# EAGLE design q3 (EAGLE 9.6.2)
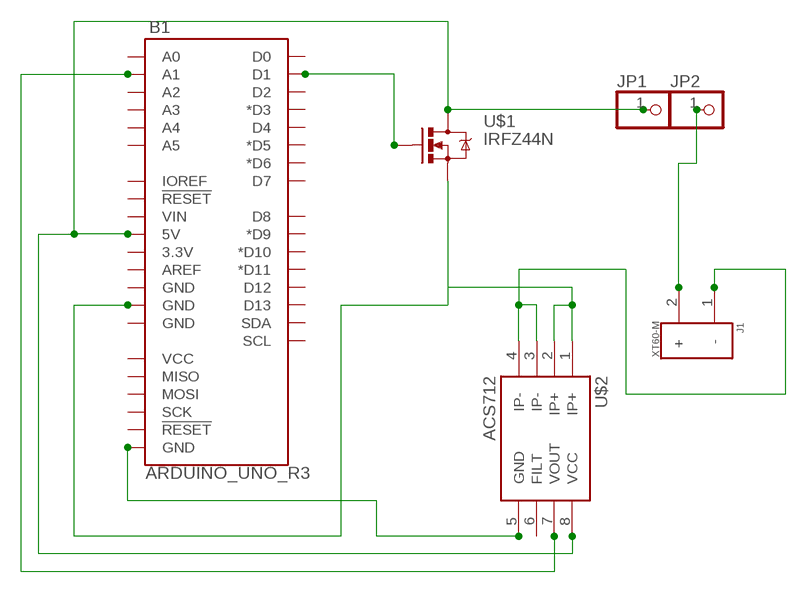
[diagram p0: schematic, sheet 1]

## Parts
B1  ARDUINO_UNO_R3  [ARDUINO_R3]
J1  XT60-M  [AMASS_XT60-M]
JP1  PINHD-1X1  [1X01]
JP2  PINHD-1X1  [1X01]
U$1  IRFZ44N  [TO-220]
U$2  ACS712  [SO08]

## Nets
N$1: J1.1(-) U$2.3(IP-) U$2.4(IP-)
N$2: J1.2(+) JP2.1
N$3: B1.5V JP1.1 U$1.2(D) U$2.8(VCC)
N$4: B1.GND@3(GND) U$1.3(S) U$2.1(IP+) U$2.2(IP+)
N$5: B1.D1 U$1.1(G)
N$6: B1.A1 U$2.7(VOUT)
N$9: B1.GND@1(GND) U$2.5(GND)
Unconnected: B1.3.3V B1.A0 B1.A2 B1.A3 B1.A4 B1.A5 B1.AREF B1.D0 B1.D2 B1.D3(*D3) B1.D4 B1.D5(*D5) B1.D6(*D6) B1.D7 B1.D8 B1.D9(*D9) B1.D10(*D10) B1.D11(*D11) B1.D12 B1.D13 B1.GND@2(GND) B1.GND@4(GND) B1.IOREF B1.MISO B1.MOSI B1.RESET@1(!RESET!) B1.RESET@2(!RESET!) B1.SCK B1.SCL B1.SDA B1.VCC B1.VIN U$2.6(FILT)

## Library data of the parts
B1 = SparkFun-Boards:ARDUINO_UNO_R3: Arduino R3 Footprint with SPI header Arduino Uno R3 Compatible Footprint. Matches PCB size of the original board. SparkFun Products: SAMD21 Dev Breakout <https://www.sparkfun.com/products/13672> RedBoard <https://www.sparkfun.com/products/12757> R3 Stackable Headers <https://www.sparkfun.com/products/11417>
J1 = XT60-M:XT60-M: DC supply; XT60; male; PIN:2; for cable; soldered; 60A; 500V; AVAILABILITY: Unavailable; DESCRIPTION: Plug; DC supply; XT60; male; PIN: 2; for cable; soldered; 30A; 500V; MF: AMASS; MP: XT60-M; PACKAGE: Package; PRICE: None
JP1 JP2 = adafruit:PINHD-1X1: Pin header 1x1 for 0.1" spacing With round pins
U$1 = IRFZ44N:IRFZ44N; AVAILABILITY: Unavailable; DESCRIPTION: N-Channel 55V 49A (Tc) 3.8W (Ta), 94W (Tc) Through Hole TO-262; MF: Infineon Technologies; MP: IRFZ44N; PACKAGE: D2PAK NXP Semiconductors; PRICE: None
U$2 = SparkFun-Sensors:ACS712: ACS712 Hall-effect-based isolated linear current sensor Datasheet <http://www.sparkfun.com/datasheets/BreakoutBoards/0712.pdf> SparkFun Products SparkFun Low Current Sensor Breakout - ACS712 <https://www.sparkfun.com/products/8883> (SEN-08883); PROD_ID: IC-08964

## Board
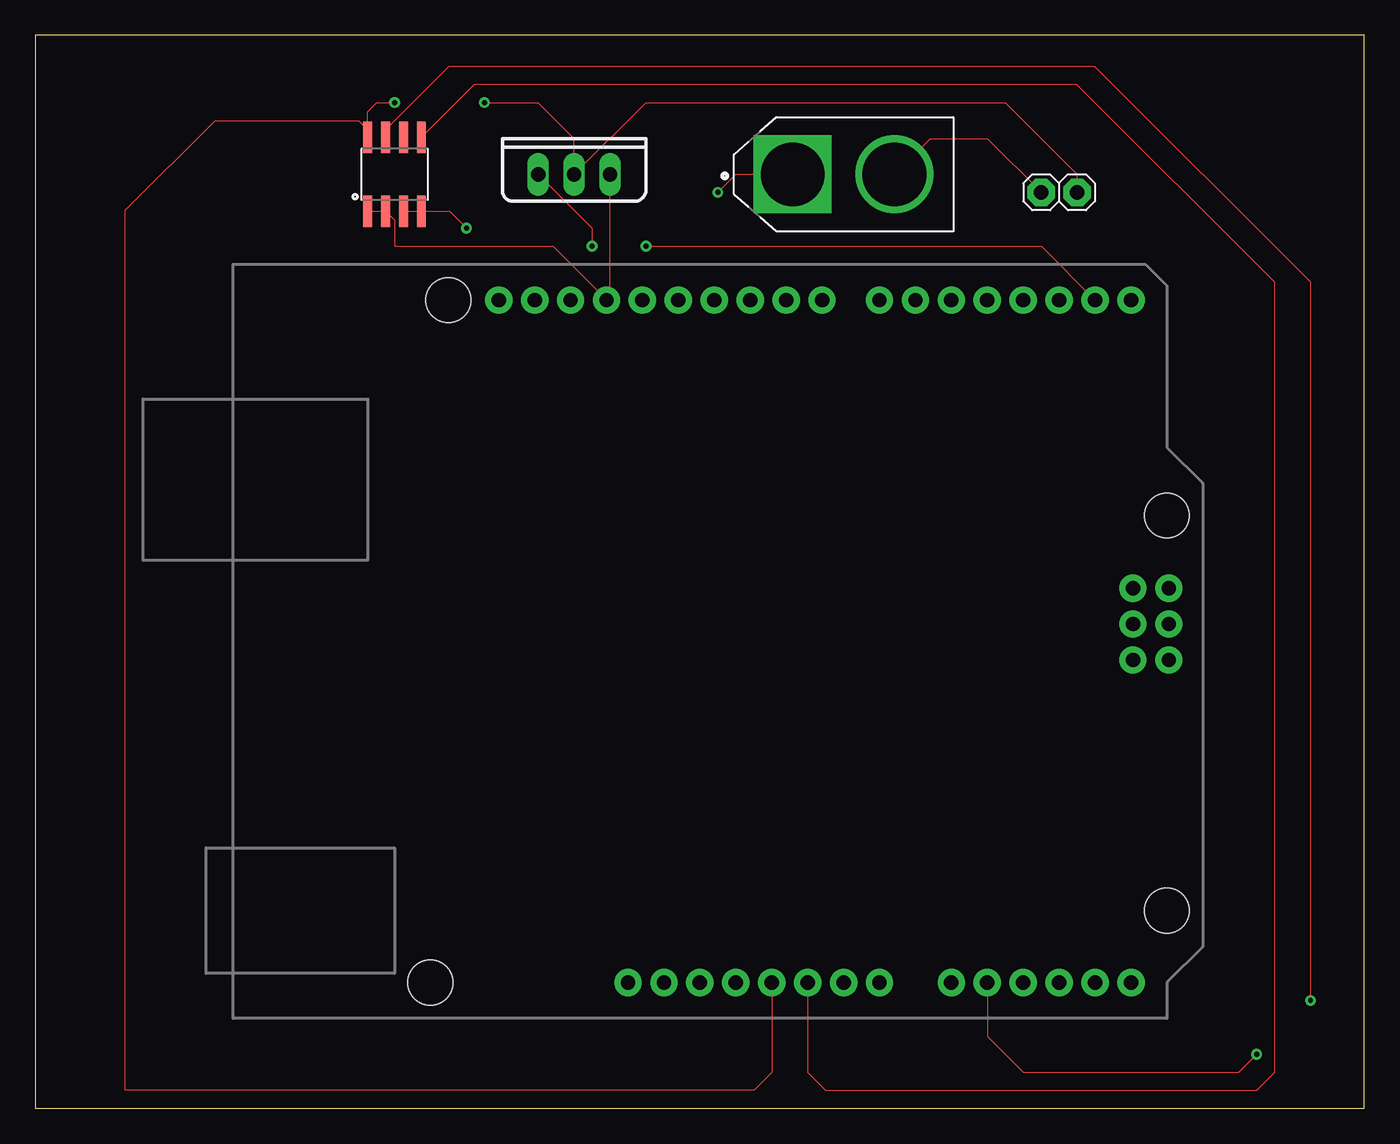
[diagram p1: board, top side]
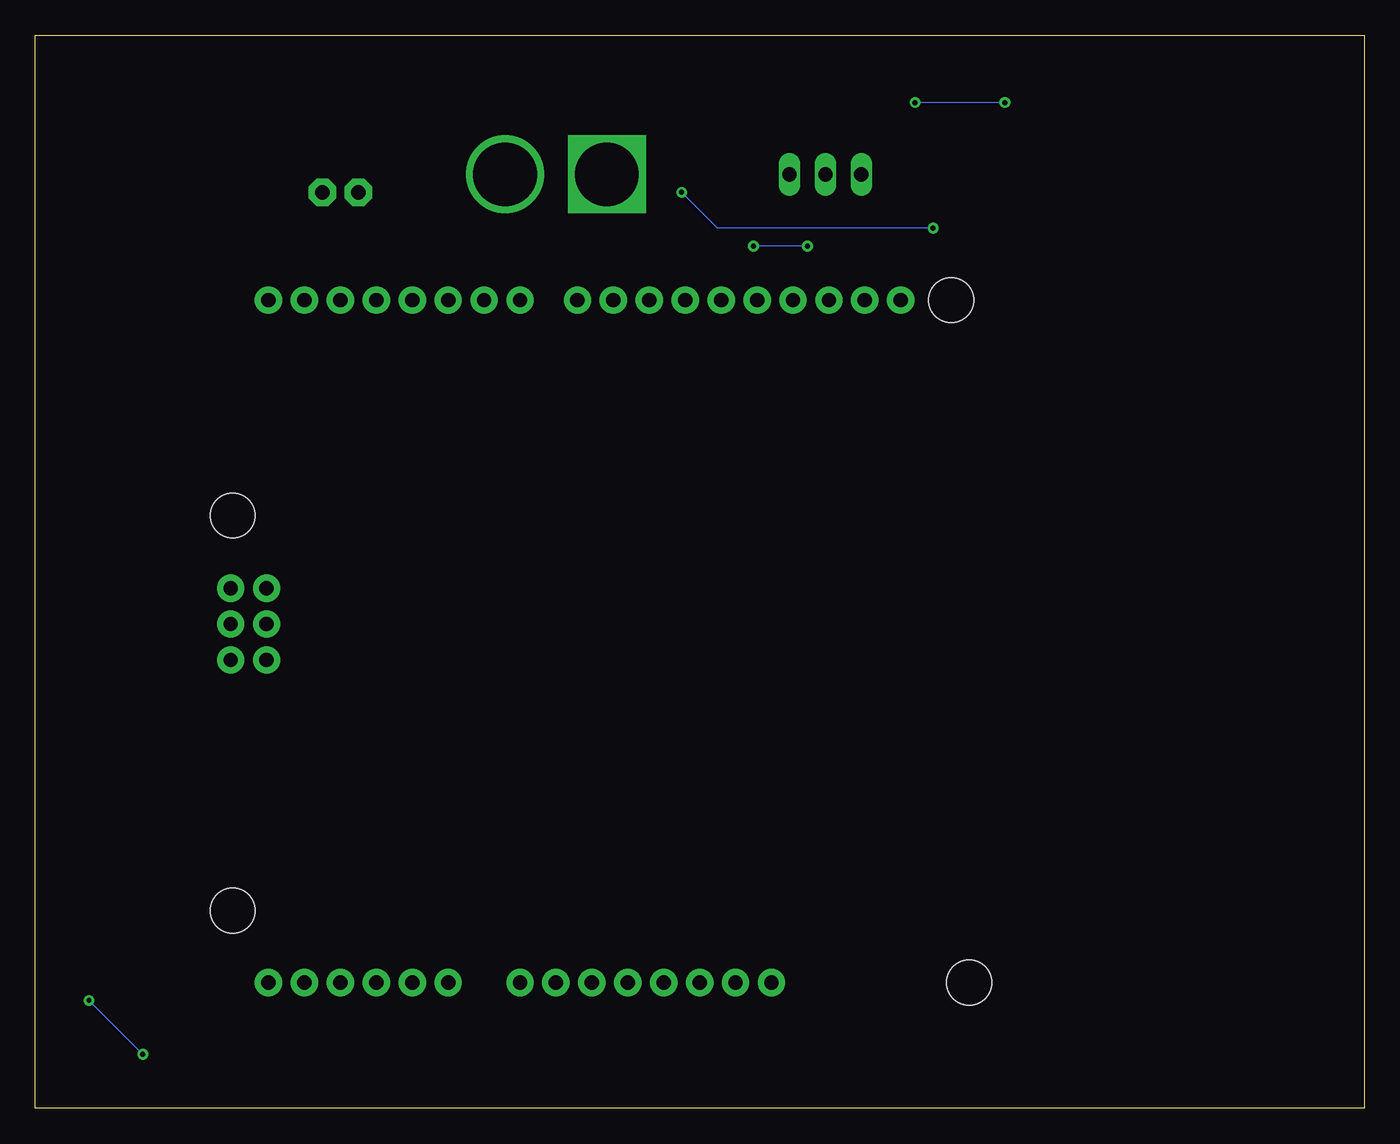
[diagram p2: board, bottom side, seen from below]

Size 93.96 x 75.87 mm. Coordinates in mm from the lower left corner, seen from the top.
Outline: 0,0 93.96,0 93.96,75.87 0,75.87 0,0
Copper layers (1*16): Top 0.035mm / dielectric 1.5mm / Bottom 0.035mm
Design rules "default *": minimum track width 0.002540625mm, minimum drill 0.35mm, track to track 6mil, track to pad 6mil, pad to pad 6mil, via to via 6mil, smd to smd 6mil, copper to edge 40mil, drill to drill 6mil, minimum pad ring 10mil, minimum via ring 8mil, stop-mask expansion 4mil, vias tented up to drill 0mil, thermal gap 10mil

### Footprints (pad centres in the part's own frame; a part is rotated, then mirrored left to right if it is on the bottom)
ARDUINO_R3 = drill 1.016 pad 1.93: 3.3V 2.54,-24.13; 5V 5.08,-24.13; A0 17.78,-24.13; A1 20.32,-24.13; A2 22.86,-24.13; A3 25.4,-24.13; A4 27.94,-24.13; A5 30.48,-24.13; AREF -9.144,24.13; D0 30.48,24.13; D1 27.94,24.13; D2 25.4,24.13; D3 22.86,24.13; D4 20.32,24.13; D5 17.78,24.13; D6 15.24,24.13; D7 12.7,24.13; D8 8.636,24.13; D9 6.096,24.13; D10 3.556,24.13; D11 1.016,24.13; D12 -1.524,24.13; D13 -4.064,24.13; GND@1 7.62,-24.13; GND@2 10.16,-24.13; GND@3 -6.604,24.13; GND@4 33.16,-1.32; IOREF -2.54,-24.13; MISO 30.62,3.76; MOSI 33.16,1.22; NC -5.08,-24.13; RESET@1 0,-24.13; RESET@2 30.62,-1.32; SCK 30.62,1.22; SCL -14.224,24.13; SDA -11.684,24.13; VCC 33.16,3.76; VIN 12.7,-24.13 | hole 3.175: -17.78,24.13; 33.02,8.89; 33.02,-19.05; -19.05,-24.13
AMASS_XT60-M = drill 4.5 square: 1 -3.6,0 | drill 4.5: 2 3.6,0
1X01 = drill 1.016 pad 1.93 octagon: 1 0,0
TO-220 = drill 1 long: 1 -2.54,0; 2 0,0; 3 2.54,0
SO08 = smd 0.61 x 2.21: 1 -1.905,-2.616; 2 -0.635,-2.616; 3 0.635,-2.616; 4 1.905,-2.616; 5 1.905,2.616; 6 0.635,2.616; 7 -0.635,2.616; 8 -1.905,2.616

### Placement (x,y rotation side)
B1  46.99,33.02 0 top
J1  57.15,66.04 0 top
JP1  73.66,64.77 0 top
JP2  71.12,64.77 0 top
U$1  38.1,66.04 0 top
U$2  25.4,66.04 0 top

### Tracks (layer width: path | path; a pad name or v marks a point on that pad's centre or on a via)
N$1  (via drill 0.35)
  Top 0.063: U$2.3 U$2.4 29.29,63.42 v30.48,62.23 | v48.26,64.77 49.53,66.04 J1.1
  Bottom 0.063: v48.26,64.77 45.72,62.23 v30.48,62.23
N$2
  Top 0.063: J1.2 63.29,68.58 67.31,68.58 JP2.1
N$3  (via drill 0.35)
  Top 0.007: B1.5V 52.07,2.54 50.8,1.27 6.35,1.27 6.35,63.5 12.7,69.85 22.86,69.85 23.49,69.22 U$2.8 23.49,70.48 24.13,71.12 v25.4,71.12 | v31.75,71.12 35.56,71.12 38.1,68.58 U$1.2
  Top 0.063: U$1.2 43.18,71.12 68.58,71.12 73.66,66.04 JP1.1
  Bottom 0.007: v25.4,71.12 v31.75,71.12
N$4
  Top 0.007: B1.GND@3 40.39,57.17
  Top 0.063: U$2.1 U$2.2 25.4,62.79 25.4,60.96 36.6,60.96 40.39,57.17 | B1.GND@3 40.64,57.4 40.64,59.69 U$1.3
N$5  (via drill 0.35)
  Top 0.063: U$1.1 39.37,62.23 v39.37,60.96 | v43.18,60.96 71.12,60.96 B1.D1
  Bottom 0.063: v39.37,60.96 v43.18,60.96
N$6  (via drill 0.35)
  Top 0.007: B1.A1 67.31,5.08 69.85,2.54 85.09,2.54 v86.36,3.81 | v90.17,7.62 90.17,58.42 74.93,73.66 29.21,73.66 24.76,69.22 U$2.7
  Bottom 0.007: v86.36,3.81 v90.17,7.62
N$9
  Top 0.007: B1.GND@1 54.61,2.54 55.88,1.27 86.36,1.27 87.63,2.54 87.63,58.42 73.66,72.39 31.04,72.39 U$2.5